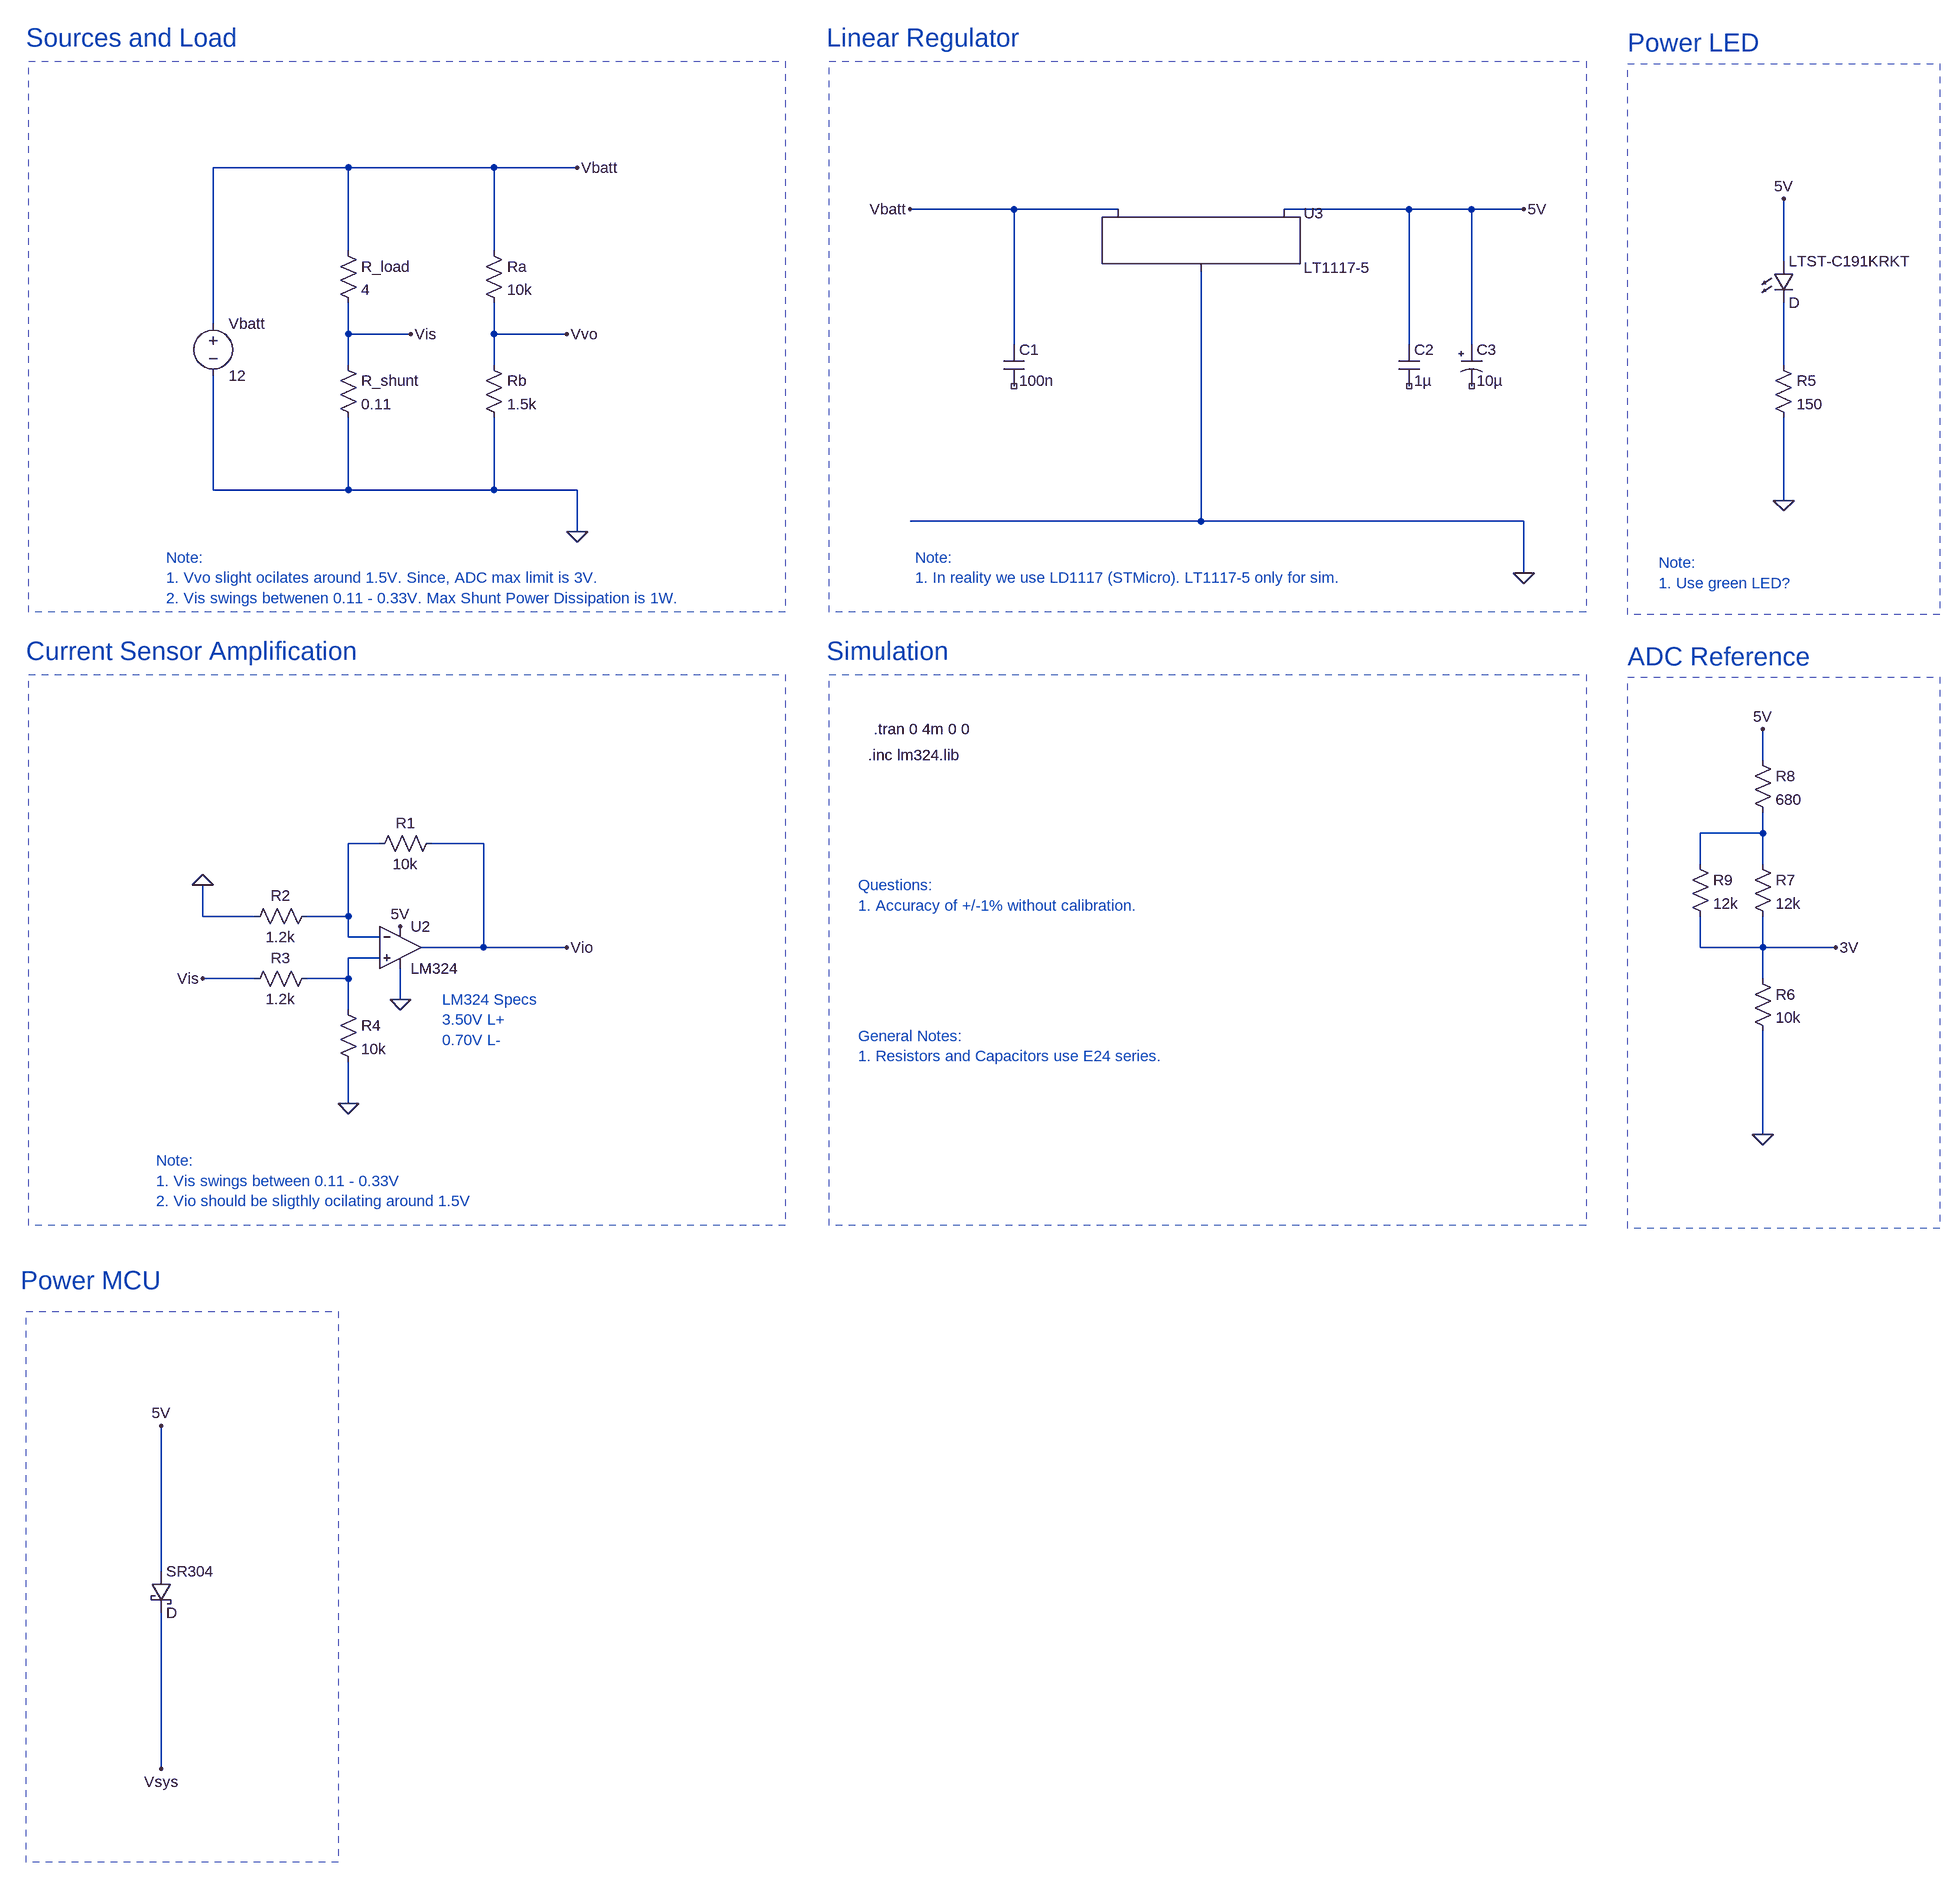
[diagram p0: schematic energy_monitor.asc]
energy_monitor.asc, the LTspice schematic file:
Version 4
SHEET 1 2724 2896
WIRE 272 224 64 224
WIRE 496 224 272 224
WIRE 624 224 496 224
WIRE 1296 288 1136 288
WIRE 1456 288 1296 288
WIRE 1904 288 1712 288
WIRE 2000 288 1904 288
WIRE 2080 288 2000 288
WIRE 272 352 272 224
WIRE 496 352 496 224
WIRE 2480 368 2480 272
WIRE 64 464 64 224
WIRE 272 480 272 432
WIRE 368 480 272 480
WIRE 496 480 496 432
WIRE 608 480 496 480
WIRE 1296 496 1296 288
WIRE 1904 496 1904 288
WIRE 2000 496 2000 288
WIRE 272 528 272 480
WIRE 496 528 496 480
WIRE 2480 528 2480 432
WIRE 64 720 64 544
WIRE 272 720 272 608
WIRE 272 720 64 720
WIRE 496 720 496 608
WIRE 496 720 272 720
WIRE 624 720 496 720
WIRE 2480 736 2480 608
WIRE 1584 768 1584 384
WIRE 1584 768 1136 768
WIRE 2080 768 1584 768
WIRE 624 784 624 720
WIRE 2080 848 2080 768
WIRE 2448 1136 2448 1088
WIRE 2448 1248 2448 1216
WIRE 2448 1248 2352 1248
WIRE 320 1264 272 1264
WIRE 480 1264 400 1264
WIRE 2352 1296 2352 1248
WIRE 2448 1296 2448 1248
WIRE 48 1376 48 1328
WIRE 128 1376 48 1376
WIRE 272 1376 272 1264
WIRE 272 1376 208 1376
WIRE 272 1408 272 1376
WIRE 320 1408 272 1408
WIRE 480 1424 480 1264
WIRE 480 1424 384 1424
WIRE 608 1424 480 1424
WIRE 2352 1424 2352 1376
WIRE 2448 1424 2448 1376
WIRE 2448 1424 2352 1424
WIRE 2560 1424 2448 1424
WIRE 320 1440 272 1440
WIRE 128 1472 48 1472
WIRE 272 1472 272 1440
WIRE 272 1472 208 1472
WIRE 2448 1472 2448 1424
WIRE 352 1504 352 1456
WIRE 272 1520 272 1472
WIRE 272 1664 272 1600
WIRE 2448 1712 2448 1552
WIRE -16 2384 -16 2160
WIRE -16 2688 -16 2448
FLAG 624 784 0
FLAG 368 480 Vis
FLAG 352 1504 0
FLAG 48 1328 0
FLAG 624 224 Vbatt
FLAG 48 1472 Vis
FLAG 2080 848 0
FLAG 1136 288 Vbatt
FLAG 2080 288 5V
FLAG 352 1392 5V
FLAG 608 1424 Vio
FLAG 608 480 Vvo
FLAG 2480 736 0
FLAG 2480 272 5V
FLAG 2448 1712 0
FLAG 2448 1088 5V
FLAG 2560 1424 3V
FLAG -16 2160 5V
FLAG -16 2688 Vsys
FLAG 272 1664 0
SYMBOL Res 256 336 R0
SYMATTR InstName R_load
SYMATTR Value 4
SYMBOL Res 256 512 R0
SYMATTR InstName R_shunt
SYMATTR Value 0.11
SYMBOL Res 480 336 R0
SYMATTR InstName Ra
SYMATTR Value 10k
SYMBOL Res 480 512 R0
SYMATTR InstName Rb
SYMATTR Value 1.5k
SYMBOL Voltage 64 448 R0
WINDOW 123 0 0 Left 0
WINDOW 39 0 0 Left 0
SYMATTR InstName Vbatt
SYMATTR Value 12
SYMBOL Res 416 1248 R90
WINDOW 0 0 56 VBottom 2
WINDOW 3 32 56 VTop 2
SYMATTR InstName R1
SYMATTR Value 10k
SYMBOL Res 224 1360 R90
WINDOW 0 0 56 VBottom 2
WINDOW 3 32 56 VTop 2
SYMATTR InstName R2
SYMATTR Value 1.2k
SYMBOL Res 224 1456 R90
WINDOW 0 0 56 VBottom 2
WINDOW 3 32 56 VTop 2
SYMATTR InstName R3
SYMATTR Value 1.2k
SYMBOL Res 256 1504 R0
SYMATTR InstName R4
SYMATTR Value 10k
SYMBOL cap 1280 496 R0
SYMATTR InstName C1
SYMATTR Value 100n
SYMBOL LT1117-5 1584 288 R0
SYMATTR InstName U3
SYMBOL LED 2464 368 R0
SYMATTR InstName LTST-C191KRKT
SYMBOL res 2464 512 R0
SYMATTR InstName R5
SYMATTR Value 150
SYMBOL cap 1888 496 R0
SYMATTR InstName C2
SYMATTR Value 1µ
SYMBOL polcap 1984 496 R0
SYMATTR InstName C3
SYMATTR Value 10µ
SYMBOL OpAmps/opamp2 352 1360 R0
SYMATTR InstName U2
SYMATTR Value LM324
SYMBOL schottky -32 2384 R0
SYMATTR InstName SR304
SYMBOL Res 2432 1456 R0
SYMATTR InstName R6
SYMATTR Value 10k
SYMBOL Res 2432 1280 R0
SYMATTR InstName R7
SYMATTR Value 12k
SYMBOL Res 2432 1120 R0
SYMATTR InstName R8
SYMATTR Value 680
SYMBOL Res 2336 1280 R0
SYMATTR InstName R9
SYMATTR Value 12k
TEXT -224 24 Left 4 ;Sources and Load
TEXT -224 968 Left 4 ;Current Sensor Amplification
TEXT 1008 24 Left 4 ;Linear Regulator
TEXT 1008 968 Left 4 ;Simulation
TEXT 1072 1128 Left 2 !.inc lm324.lib
TEXT 1080 1088 Left 2 !.tran 0 4m 0 0
TEXT 1056 1560 Left 2 ;General Notes:\n1. Resistors and Capacitors use E24 series.
TEXT 1056 1328 Left 2 ;Questions:\n1. Accuracy of +/-1% without calibration.
TEXT 1144 824 Left 2 ;Note:\n1. In reality we use LD1117 (STMicro). LT1117-5 only for sim.
TEXT 2240 32 Left 4 ;Power LED
TEXT -24 1752 Left 2 ;Note:\n1. Vis swings between 0.11 - 0.33V\n2. Vio should be sligthly ocilating around 1.5V
TEXT -8 824 Left 2 ;Note:\n1. Vvo slight ocilates around 1.5V. Since, ADC max limit is 3V.\n2. Vis swings betwenen 0.11 - 0.33V. Max Shunt Power Dissipation is 1W.
TEXT 2288 832 Left 2 ;Note:\n1. Use green LED?
TEXT 2240 976 Left 4 ;ADC Reference
TEXT 416 1504 Left 2 ;LM324 Specs\n3.50V L+\n0.70V L-
TEXT -232 1936 Left 4 ;Power MCU
RECTANGLE Normal -220 60 944 908 1
RECTANGLE Normal -220 1004 944 1852 1
RECTANGLE Normal 1012 60 2176 908 1
RECTANGLE Normal 1012 1004 2176 1852 1
RECTANGLE Normal 2720 912 2240 64 1
RECTANGLE Normal 2720 1856 2240 1008 1
RECTANGLE Normal 256 2832 -224 1984 1

The netlist it stands for:
* energy_monitor.asc
R_load Vbatt Vis 4
R_shunt Vis 0 0.11
Ra Vbatt Vvo 10k
Rb Vvo 0 1.5k
Vbatt Vbatt 0 12
R1 Vio N003 10k
R2 N003 0 1.2k
R3 N004 Vis 1.2k
R4 N004 0 10k
C1 Vbatt NC_01 100n
XU3 0 5V Vbatt LT1117-5
D§LTST-C191KRKT 5V N001 D
R5 N001 0 150
C2 5V NC_02 1µ
C3 5V NC_03 10µ
XU2 N004 N003 5V 0 Vio LM324  ; pins In+ In- V+ V- OUT
D§SR304 5V Vsys D
R6 3V 0 10k
R7 N002 3V 12k
R8 5V N002 680
R9 N002 3V 12k
.model D D
.lib standard.dio
* Sources and Load
* Current Sensor Amplification
* Linear Regulator
* Simulation
.inc lm324.lib
.tran 0 4m 0 0
* General Notes:
* 1. Resistors and Capacitors use E24 series.
* Questions:
* 1. Accuracy of +/-1% without calibration.
* Note:
* 1. In reality we use LD1117 (STMicro). LT1117-5 only for sim.
* Power LED
* Note:
* 1. Vis swings between 0.11 - 0.33V
* 2. Vio should be sligthly ocilating around 1.5V
* Note:
* 1. Vvo slight ocilates around 1.5V. Since, ADC max limit is 3V.
* 2. Vis swings betwenen 0.11 - 0.33V. Max Shunt Power Dissipation is 1W.
* Note:
* 1. Use green LED?
* ADC Reference
* LM324 Specs
* 3.50V L+
* 0.70V L-
* Power MCU
.backanno
.end